# Altium schematic sheet I2C-LX.SchDoc: =ProjectTitle
size 209 x 297 mm; Address1: Address1; Address2: Address2; Address3: Address3; Address4: Address4; SheetNumber: 3; SheetTotal: 9; Scale: 1:1; DocumentType: Схема электрическая принципиальная
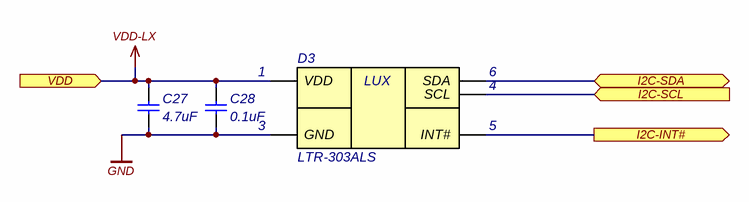
[diagram p0: I2C-LX.SchDoc]

## Parts
C27  4.7uF  [C0402]
C28  0.1uF  [C0402]
D3  LTR-303ALS  [ChipLED-6]

## Ports
I2C-INT# (out), I2C-SCL (in), I2C-SDA (bidir), VDD (in)

## Nets
GND: C27.1 C28.1 D3.3(GND)
VDD-LX: C27.2 C28.2 D3.1(VDD) ; port VDD
I2C-INT#: D3.5(INT#) ; port I2C-INT#
I2C-SCL: D3.4(SCL) ; port I2C-SCL
I2C-SDA: D3.6(SDA) ; port I2C-SDA

## Notes on the sheet
- Подп. и дата
- Инв. № дубл.
- Взам. инв. №
- Symbol name: =SheetSymbolDesignator
  File name: =DocumentName
  Variant name (Short): =ProjectVariant ( =ProjectBoardVariant )
  Version on board: =ProjectRevisionCode
- Инв. № подл.
- Изм.
- Лист
- № докум.
- Подп.
- Дата
- 2.106-A4
- Копировал
- Формат А4
- (in symbol LTR-303ALS) LUX

## Library data of the parts
C27 = 0402-X5R-6.3V-4.7uF±20%: Manufacturer: Yageo; NameFromManufacturer: CC0402MRX5R5BB475; Place: S; Voltage: 6.3V; Tolerance: 20%; Check: False; Part Number: 0402-X5R-6.3V-4.7uF±20%; Value: 4.7uF; Temperature: -55°C~125°C; ComponentLink2Description: Link to datasheet; ComponentLink1Description: DATASHEET; ComponentLink2URL: https://ru.mouser.com/ProductDetail/YAGEO/CC0402MRX5R5BB475?qs=%2Fha2pyFadujQAk9rG2cgJpeZ0BKEEZe0MyMZqMwsns5cG502XdwDVw%3D%3D; ComponentLink1URL: Datasheets/capacitors/UPY-GPHC_X5R_4V-to-50V_27.pdf; Last changed: 27.10.2022
C28 = 0402-X7R-16V-0.1uF±10%: Manufacturer: Yageo; NameFromManufacturer: CC0402JRX7R7BB104; Place: S; Voltage: 16V; Tolerance: 5%; Check: False; Annotation: *; Param: *; Value: 0.1uF; Part Number: 0402-X7R-16V-0.1uF±10%; Temperature: -55°C~125°C; ComponentLink1Description: DATASHEET; ComponentLink1URL: https://www.yageo.com/upload/media/product/productsearch/datasheet/mlcc/UPY-GPHC_X7R_6.3V-to-50V_18.pdf; Datasheet: #https://www.yageo.com/upload/media/product/productsearch/datasheet/mlcc/UPY-GPHC_X7R_6.3V-to-50V_18.pdf#; Last changed: 31.03.2021
D3 = LTR-303ALS: I2C Ambient Light Sensor ChipLED-6; Manufacturer: Lite-On; NameFromManufacturer: LTR-303ALS-01; Place: T; Check: False; Part Number: LTR-303ALS; Temperature: -30°C~70°C; Value: LTR-303ALS; ComponentLink1Description: DATASHEET; ComponentLink1URL: https://www.lcsc.com/product-detail/Ambient-Light-Sensors_Lite-On-LTR-303ALS-01_C364577.html; Last changed: 21.01.2024